# Altium schematic sheet CommonComponents.SchDoc
size Letter; CompanyName: Penn Electric Racing; Organization: Penn Electric Racing; Address1: 220 S. 33rd St; Address2: Towne Bldg, B11; Address3: Philadelpia, PA 19104; Address4: USA; SheetNumber: 1; SheetTotal: 11
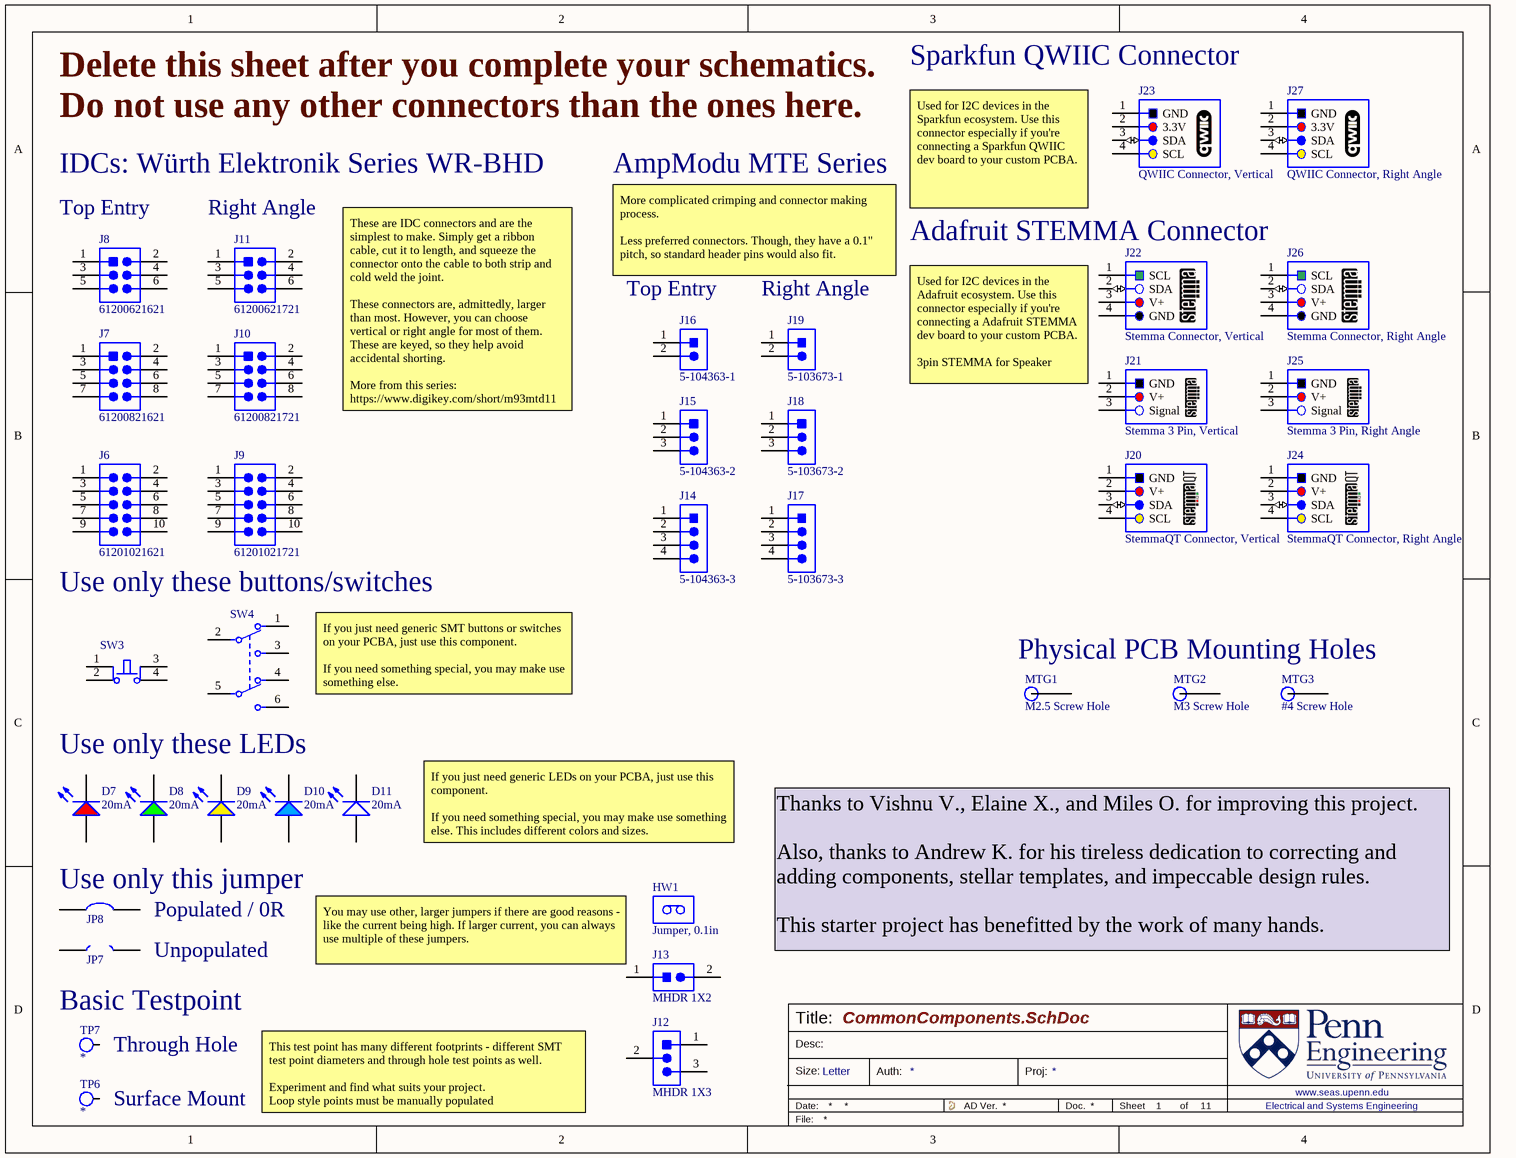
[diagram p0: CommonComponents.SchDoc]

## Parts
D7  Current: 20mA  [LED_0805_RED]  (hidden comment: LSM0805412V)
D8  Current: 20mA  [LED_0805]  (hidden comment: LSM0805452V)
D9  Current: 20mA  [LED_0805_YELLOW]  (hidden comment: LSM0805472V)
D10  Current: 20mA  [LED_0805_BLUE]  (hidden comment: LSM0805463V)
D11  Current: 20mA  [LED_0805_WHITE]  (hidden comment: LSM0805543V)
HW1  Jumper, 0.1in  (mechanical)
J6  61201021621  [61201021621]
J7  61200821621  [61200821621]
J8  61200621621  [61200621621]
J9  61201021721  [61201021721]
J10  61200821721  [61200821721]
J11  61200621721  [61200621721]
J12  MHDR 1X3  [PH1-03-UA WITH CONNECTOR]
J13  MHDR 1X2  [PH1-02-UA]
J14  5-104363-3  [5-104363-3-Footprint-1]
J15  5-104363-2  [5-104363-2-Footprint-1]
J16  5-104363-1  [5-104363-1-Footprint-1]
J17  5-103673-3  [5-103673-3_TYC]
J18  5-103673-2  [5-103673-2-Footprint-1]
J19  5-103673-1  [5-103672-1-Footprint-1]
J20  StemmaQT Connector, Vertical  [FP-BM04B-SRSS-TBT_LF_SN-MFG stemmaqt]
J21  Stemma 3 Pin, Vertical  [FP-B3B-PH-SM4-TBT_LF_SN-MFG]
J22  Stemma Connector, Vertical  [FP-B4B-PH-SM4-TBT_LF_SN-MFG]
J23  QWIIC Connector, Vertical  [FP-BM04B-SRSS-TBT_LF_SN-MFG qwiic]
J24  StemmaQT Connector, Right Angle  [SM04B-SRSS-TB(LF)(SN)-stemmaqt]
J25  Stemma 3 Pin, Right Angle  [FP-S3B-PH-SM4-TB_LF_SN-MFG]
J26  Stemma Connector, Right Angle  [S4B-PH-SM4-TB-Footprint-1]
J27  QWIIC Connector, Right Angle  [SM04B-SRSS-TB(LF)(SN)-qwiic]
JP7  0603 link (Open)  [0603_JP_Open]  (value not drawn)  (no BOM)
JP8  0603 link  [0603_JP_RES]  (value not drawn)
MTG1  M2.5 Screw Hole  [M2.5 Screw Hole-Footprint-1]  (no BOM)
MTG2  M3 Screw Hole  [M3 Screw Hole-Footprint-1]  (no BOM)
MTG3  #4 Screw Hole  [MTG-4]  (no BOM)
SW3  PTS810SJK250SMTRLFS  [PTS810SJK250SMTRLFS-Footprint-1]  (value not drawn)
SW4  JS202011JCQN  [FP-JS202011JCQN-MFG]  (value not drawn)
TP6  Testpad  [SMT Testpoint, 50mil]  (value not drawn)  (no BOM)
TP7  Testpad  [Testpad-HeaderPin]  (value not drawn)  (no BOM)

## Nets

Not connected (* = marked no-connect by the designer): D7 A K; D8 A K; D9 A K; D10 A K; D11 A K; J6 1 2 3 4 5 6 7 8 9 10; J7 1 2 3 4 5 6 7 8; J8 1 2 3 4 5 6; J9 1 2 3 4 5 6 7 8 9 10; J10 1 2 3 4 5 6 7 8; J11 1 2 3 4 5 6; J12 1 2 3; J13 1 2; J14 1 2 3 4; J15 1 2 3; J16 1 2; J17 1 2 3 4; J18 1 2 3; J19 1 2; J20 1(GND) 2(V+) 3(SDA) 4(SCL); J21 1(GND) 2(V+) 3(Signal); J22 1(SCL) 2(SDA) 3(V+) 4(GND); J23 1(GND) 2(3.3V) 3(SDA) 4(SCL); J24 1(GND) 2(V+) 3(SDA) 4(SCL); J25 1(GND) 2(V+) 3(Signal); J26 1(SCL) 2(SDA) 3(V+) 4(GND); J27 1(GND) 2(3.3V) 3(SDA) 4(SCL); JP7 1 2; JP8 1 2; MTG1 1; MTG2 1; MTG3 1; SW3 1 2 3(2) 4; SW4 1 2 3 4 5 6; TP6 1; TP7 1

## Notes on the sheet
- Delete this sheet after you complete your schematics.
- Sparkfun QWIIC Connector
- Do not use any other connectors than the ones here.
- IDCs: Würth Elektronik Series WR-BHD
- (near J8) Top Entry
- (near J11) Right Angle
- AmpModu MTE Series
- Used for I2C devices in the Sparkfun ecosystem. Use this connector especially if you're connecting a Sparkfun QWIIC dev board to your custom PCBA.
- More complicated crimping and connector making process.
  Less preferred connectors. Though, they have a 0.1" pitch, so standard header pins would also fit.
- (near J16) Top Entry
- (near J19) Right Angle
- Adafruit STEMMA Connector
- These are IDC connectors and are the simplest to make. Simply get a ribbon cable, cut it to length, and squeeze the connector onto the cable to both strip and cold weld the joint.
  These connectors are, admittedly, larger than most. However, you can choose vertical or right angle for most of them. These are keyed, so they help avoid accidental shorting.
  More from this series: https://www.digikey.com/short/m93mtd11
- Used for I2C devices in the Adafruit ecosystem. Use this connector especially if you're connecting a Adafruit STEMMA dev board to your custom PCBA.
  3pin STEMMA for Speaker
- Use only these buttons/switches
- If you just need generic SMT buttons or switches on your PCBA, just use this component.
  If you need something special, you may make use something else.
- Physical PCB Mounting Holes
- (near SW4) Use only these LEDs
- If you just need generic LEDs on your PCBA, just use this component.
  If you need something special, you may make use something else. This includes different colors and sizes.
- (near JP8) Use only this jumper
- Populated / 0R
- Unpopulated
- You may use other, larger jumpers if there are good reasons - like the current being high. If larger current, you can always use multiple of these jumpers.
- Thanks to Vishnu V., Elaine X., and Miles O. for improving this project.
  Also, thanks to Andrew K. for his tireless dedication to correcting and adding components, stellar templates, and impeccable design rules.
  This starter project has benefitted by the work of many hands.
- Basic Testpoint
- (near TP7) Through Hole
- (near TP6) Surface Mount
- This test point has many different footprints - different SMT test point diameters and through hole test points as well.
  Experiment and find what suits your project.
  Loop style points must be manually populated
- Title:
- Desc:
- Size:
- Letter
- Auth:
- Proj:
- Sheet
- of
- www.seas.upenn.edu
- Electrical and Systems Engineering

## Library data of the parts
D7 = CMP-00026-00001-2: Single Color LED, RED, 0805; Forward Voltage: 2V; Wavelength - Peak: 625nm; RoHS Compliant: Yes; Test Current: 20mA; Color: Red; Wavelength - Dominant: 625nm
D8 = CMP-00038-4: Single Color LED, Green, 0805; Forward Voltage: 2V; Wavelength - Peak: 571nm; Package (Case): 0805; Test Current: 20mA; RoHS Compliant: Yes; Wavelength - Dominant: 571nm; Color: Green
D9 = CMP-031-000001-1: LED Uni-Color Yellow 590nm Automotive 2-Pin Chip 0805(2012Metric) T/R; Forward Voltage: 2V; RoHS Compliant: Yes; Test Current: 20mA; Color: Yellow
D10 = CMP-00457-1: LED Uni-Color Blue 469nm Automotive 2-Pin Chip 0805(2012Metric) T/R; Package (Case): 0805; Color: Bllue; Forward Voltage: 3V; Wavelength - Dominant: 469nm; Wavelength - Peak: 469nm; Test Current: 20mA; RoHS Compliant: Yes
D11 = CMP-00535-1: LED Uni-Color Blue 469nm Automotive 2-Pin Chip 0805(2012Metric) T/R; Forward Voltage: 3V; Package (Case): 0805; Millicandela Rating: 280m; Color: White; Test Current: 20mA; RoHS Compliant: Yes
HW1 = CMP-00051-1: 2 (1 x 2) Position Shunt Connector, No Grip 0.100" (2.54mm) Gold
J6 = CMP-00633-1: Board Connector, 10 Contact(s), 2 Row(s), Male, Straight, 0.1 inch Pitch, Solder Terminal, Locking, Black Insulator, Receptacle; Manufacturer Series: 6120; PCB Contact Row Spacing: 2.54mm; Body Depth: 0.358inch; MIL Conformance: No; Contact Pattern: RECTANGULAR; Reference Standard: UL; Rated Current (Signal): 3A; Number of Contacts: 10; Contact Style: SQ PIN-SKT; Dielectric Withstanding Voltage (AC): 500V; Polarization Key: POLARIZED HOUSING; Contact Resistance: 20mR; Reliability: COMMERCIAL; Number Of Connectors: 1; Number of Rows Loaded: 2; Option: General Purpose; Body Length: 0.702inch; Insulation Resistance: 1GR; Flammability Rating: UL94 V-0; Number of Rows: 2; Mating Contact Row Spacing: 0.1inch; Terminal Length: 0.118inch; Contact Finish - Mating: GOLD; Max Operating Temperature: 125°C; Termination: Solder; Reach SVHC Compliant: Yes; IEC Conformance: No; PCB Contact Pattern: RECTANGULAR; DIN Conformance: No; Insulation Material: Polybutylene; RoHS Compliant: Yes; JESD-609 Code: e4; Pitch: 2.54mm; Mounting Technology: Board; Mounting Style: STRAIGHT; Mating Contact Pitch: 0.1inch; Insulation Color: Black; Filter Feature: No; Connector Type: BOARD CONNECTOR; Body/Shell Style: RECEPTACLE; Contact Material: Copper Alloy; Number of Positions: 10; Min Operating Temperature: -40°C; Body Breadth: 0.358inch; Number Of PCB Rows: 2; Contact Finish - Termination: Gold (Au) - with Nickel (Ni) barrier; Mixed Contacts: No; Terminal Pitch: 2.54mm; Contact Gender: Male; Mounting Option 1: LOCKING
J7 = CMP-00554-1: Board Connector, 8 Contact(s), 2 Row(s), Male, Straight, Solder Terminal; Manufacturer Series: 6120; Contact Material: Copper Alloy; Reach SVHC Compliant: Yes; Contact Finish - Termination: Gold (Au) - with Nickel (Ni) barrier; RoHS Compliant: Yes; JESD-609 Code: e4; Contact Finish - Mating: GOLD; Connector Type: BOARD CONNECTOR
J8 = CMP-000028-1: Board Connector, 6 Contact(s), 2 Row(s), Male, Straight, Solder Terminal; DIN Conformance: No; Option: General Purpose; Number of Contacts: 6; Number of Rows Loaded: 2; Contact Finish - Mating: GOLD; Flammability Rating: UL94 V-0; RoHS Compliant: Yes; Terminal Pitch: 2.54mm; Contact Material: Copper Alloy; Contact Gender: Male; Mixed Contacts: No; REACH SVHC: Yes; JESD-609 Code: e4; Connector Type: BOARD CONNECTOR; Termination: Solder; Filter Feature: No; MIL Conformance: No; Contact Finish - Termination: Gold (Au) - with Nickel (Ni) barrier; Mount: Board; Mounting Style: STRAIGHT; IEC Conformance: No
J9 = CMP-00636-1: Board Connector, 10 Contact(s), 2 Row(s), Male, Right Angle, 0.1 inch Pitch, Solder Terminal, Locking, Black Insulator; Number of Rows Loaded: 2; PCB Contact Pattern: RECTANGULAR; Number of Contacts: 10; Pitch: 2.54mm; Reliability: COMMERCIAL; Reference Standard: UL; Contact Style: SQ PIN-SKT; Body Depth: 0.521inch; Contact Resistance: 20mR; Insulation Resistance: 1GR; Body Breadth: 0.358inch; Dielectric Withstanding Voltage (AC): 500V; Rated Current (Signal): 3A; Number Of Connectors: 1; Polarization Key: POLARIZED HOUSING; Body Length: 0.802inch; Contact Gender: Male; Mounting Option 1: LOCKING; JESD-609 Code: e4; Insulation Material: Polybutylene; PCB Contact Row Spacing: 2.54mm; Max Operating Temperature: 125°C; Terminal Length: 0.118inch; Mating Contact Pitch: 0.1inch; Contact Finish - Termination: Gold (Au); Reach SVHC Compliant: Yes; Insulation Color: Black; Contact Finish - Mating: GOLD; Number of Rows: 2; RoHS Compliant: Yes; Min Operating Temperature: -40°C; Terminal Pitch: 2.54mm; Number Of PCB Rows: 2; Contact Material: Copper Alloy; Mating Contact Row Spacing: 0.1inch; Mounting Style: RIGHT ANGLE; Mounting Technology: Board; Contact Pattern: RECTANGULAR; Number of Positions: 10; Connector Type: BOARD CONNECTOR; Termination: Solder
J10 = CMP-00555-1: Board Connector, 8 Contact(s), 2 Row(s), Male, Right Angle, 0.1 inch Pitch, Solder Terminal, Locking, Black Insulator; Manufacturer Series: 6120; Contact Pattern: RECTANGULAR; Contact Resistance: 20mR; Polarization Key: POLARIZED HOUSING; Number Of PCB Rows: 2; Insulation Resistance: 1GR; Number Of Connectors: 1; Number of Contacts: 8; Body Depth: 0.521inch; Reference Standard: UL; Dielectric Withstanding Voltage (AC): 500V; PCB Contact Row Spacing: 2.54mm; Rated Current (Signal): 3A; Reliability: COMMERCIAL; Body Breadth: 0.358inch; Contact Style: SQ PIN-SKT; Body Length: 0.702inch; Termination: Solder; Mounting Technology: Board; JESD-609 Code: e4; Mounting Option 1: LOCKING; Contact Material: Copper Alloy; Reach SVHC Compliant: Yes; Mating Contact Row Spacing: 0.1inch; Contact Finish - Termination: Gold (Au); Mounting Style: RIGHT ANGLE; Min Operating Temperature: -40°C; PCB Contact Pattern: RECTANGULAR; Insulation Material: Polybutylene; Contact Finish - Mating: GOLD; Terminal Pitch: 2.54mm; Contact Gender: Male; Insulation Color: Black; Connector Type: BOARD CONNECTOR; Mating Contact Pitch: 0.1inch; RoHS Compliant: Yes; Terminal Length: 0.118inch; Number of Rows Loaded: 2; Max Operating Temperature: 125°C
J11 = CMP-00552-1: Board Connector, 6 Contact(s), 2 Row(s), Male, Right Angle, 0.1 inch Pitch, Solder Terminal, Locking, Black Insulator; Manufacturer Series: 6120; Reference Standard: UL; Number Of Connectors: 1; Body Length: 0.602inch; Rated Current (Signal): 3A; Dielectric Withstanding Voltage (AC): 500V; Contact Pattern: RECTANGULAR; Contact Style: SQ PIN-SKT; Body Depth: 0.521inch; Contact Resistance: 20mR; Insulation Resistance: 1GR; Number Of PCB Rows: 2; Number of Contacts: 6; Polarization Key: POLARIZED HOUSING; Reliability: COMMERCIAL; PCB Contact Row Spacing: 2.54mm; Body Breadth: 0.358inch; Contact Material: Copper Alloy; Mounting Style: RIGHT ANGLE; Mounting Technology: Board; Mating Contact Row Spacing: 0.1inch; Mounting Option 1: LOCKING; PCB Contact Pattern: RECTANGULAR; Reach SVHC Compliant: Yes; Number of Rows: 2; Mating Contact Pitch: 0.1inch; Insulation Material: Polybutylene; Insulation Color: Black; RoHS Compliant: Yes; Contact Gender: Male; Termination: Solder; Connector Type: BOARD CONNECTOR; Min Operating Temperature: -40°C; Max Operating Temperature: 125°C; Contact Finish - Mating: GOLD; Number of Rows Loaded: 2; Terminal Length: 0.118inch; Pitch: 2.54mm; Contact Finish - Termination: Gold (Au); Number of Positions: 6; Terminal Pitch: 2.54mm; JESD-609 Code: e4
J12 = CMP-000023-1: Header, 3-Pin, 0.1in Pitch, Male
J13 = CMP-000021-1: Header, 2-Pin, 0.1in Pitch, Male
J14 = CMP-00105-2: Board Connector, 4 Contact(s), 1 Row(s), Male, Straight, 0.1 inch Pitch, Solder Terminal, Locking, Black Insulator, Plug
J15 = CMP-00106-1: Board Connector, 3 Contact(s), 1 Row(s), Male, Straight, 0.1 inch Pitch, Solder Terminal, Latch, Black Insulator, Plug
J16 = CMP-0000361-2: Board Connector, 2 Contact(s), 1 Row(s), Male, Straight, 0.1 inch Pitch, Solder Terminal, Latch, Black Insulator, Plug; Option: General Purpose; Body Depth: 0.535inch; Contact Pattern: RECTANGULAR; Dielectric Withstanding Voltage (AC): 600V; DIN Conformance: No; Rated Current (Signal): 3A; Body Breadth: 0.262inch; Contact Style: SQ PIN-SKT; Number of Contacts: 2; Body Length: 0.3inch; Number Of Connectors: 1; Polarization Key: POLARIZED HOUSING; Reliability: COMMERCIAL; Reference Standard: UL; Insulation Resistance: 5GR; Plating Thickness: 15uin; Mounting Option 1: LOCKING; Insulation Color: Black; Body/Shell Style: PLUG; MIL Conformance: No; REACH SVHC: Yes; Mixed Contacts: No; IEC Conformance: No; Connector Type: BOARD CONNECTOR; Min Operating Temperature: -65°C; RoHS Compliant: Yes; PCB Contact Pattern: RECTANGULAR; Mating Contact Pitch: 0.1inch; Termination: Solder; Max Operating Temperature: 105°C; Filter Feature: No; Insulation Material: Glass; Mounting Style: STRAIGHT; Mount: Board; Contact Gender: Male; Number of Rows Loaded: 1; Contact Finish - Mating: NOT SPECIFIED; Terminal Pitch: 2.54mm; Number Of PCB Rows: 1; Contact Material: Brass; Terminal Length: 0.13inch
J17 = CMP-251-000000-2: Board Connector, 4 Contact(s), 1 Row(s), Male, Right Angle, Solder Terminal, Black Insulator; Mfr_Name: TE Connectivity; Mixed Contacts: No; Number of Contacts: 4; Mating Information: MULTIPLE MATING PARTS AVAILABLE; Option: General Purpose; Number of Rows Loaded: 1; Additional Feature: POLARIZED; Termination: Solder; Design Item ID: 5-103673-3; DIN Conformance: No; RoHS Compliant: Yes; Reach SVHC Compliant: Yes; Type: Type; Mounting Technology: Board; Contact Gender: Male; Pin Count: 4; Mounting Style: RIGHT ANGLE; Filter Feature: No; Contact Material: Brass; Contact Finish - Termination: TIN; Source: 5-103673-3.SchLib; Flammability Rating: UL94 V-0; RefDes: RefDes; Component Type: Standard; Connector Type: BOARD CONNECTOR; IEC Conformance: No; Terminal Pitch: 2.54mm; MIL Conformance: No; JESD-609 Code: e3; Contact Finish - Mating: NOT SPECIFIED
J18 = CMP-00385-1: Board Connector, 3 Contact(s), 1 Row(s), Male, Right Angle, Solder Terminal, Black Insulator; Option: General Purpose; MIL Conformance: No; Number of Contacts: 3; Mating Information: MULTIPLE MATING PARTS AVAILABLE; Number of Rows Loaded: 1; Additional Feature: POLARIZED; Flammability Rating: UL94 V-0; RoHS Compliant: Yes; JESD-609 Code: e3; Contact Finish - Mating: NOT SPECIFIED; Reach SVHC Compliant: Yes; Connector Type: BOARD CONNECTOR; Filter Feature: No; IEC Conformance: No; Mounting Style: RIGHT ANGLE; Terminal Pitch: 2.54mm; Contact Material: Brass; Termination: Solder; Mounting Technology: Board; Mixed Contacts: No; Contact Finish - Termination: TIN; Contact Gender: Male; DIN Conformance: No
J19 = CMP-00384-1: Board Connector, 2 Contact(s), 1 Row(s), Male, Right Angle, 0.1 inch Pitch, Solder Terminal, Latch, Black Insulator, Receptacle; DIN Conformance: No; Rated Current (Signal): 3A; Number of Contacts: 2; Contact Pattern: RECTANGULAR; Body Depth: 0.535inch; Number Of PCB Rows: 1; Mating Information: MULTIPLE MATING PARTS AVAILABLE; Contact Style: SQ PIN-SKT; Option: General Purpose; Body Breadth: 0.275inch; Additional Feature: POLARIZED; Dielectric Withstanding Voltage (AC): 600V; Contact Resistance: 15mR; Plating Thickness: 15uin; Mounting Option 2: LOCKING; Reliability: COMMERCIAL; Body Length: 0.3inch; Insulation Resistance: 5GR; Board Mounting Option: HOLE .125-.137; Reference Standard: UL; Polarization Key: POLARIZED HOUSING; Min Operating Temperature: -65°C; Mating Contact Pitch: 0.1inch; Contact Gender: Male; Mounting Option 1: LATCH; Mounting Style: RIGHT ANGLE; Terminal Length: 0.13inch; Contact Material: Brass; PCB Contact Pattern: RECTANGULAR; JESD-609 Code: e3; Mounting Technology: Board; Body/Shell Style: RECEPTACLE; Contact Finish - Mating: NOT SPECIFIED; Number of Rows Loaded: 1; Termination: Solder; Terminal Pitch: 2.54mm; Contact Finish - Termination: TIN; IEC Conformance: No; Filter Feature: No; MIL Conformance: No; Reach SVHC Compliant: Yes; Number Of Connectors: 1; Insulation Material: Thermoplastic; Connector Type: BOARD CONNECTOR; Max Operating Temperature: 105°C; Mixed Contacts: No; Flammability Rating: UL94 V-0; Insulation Color: Black; RoHS Compliant: Yes
J20 = CMP-00562-2: Adafruit StemmaQT Connector Header, 1.0mm Pitch, Ultra-Compact, Low Profile Design, Interchangeable Shrouded Header; ComponentLink2Description: StemmaQT Info; ComponentLink1Description: qwiic info; ComponentLink1URL: https://www.sparkfun.com/qwiic; ComponentLink2URL: https://learn.adafruit.com/introducing-adafruit-stemma-qt/what-is-stemma-qt
J21 = CMP-00550-1: Adafruit Stemma 3 Pin (Analog/Digital/PWM) Connector Header, PH Series, 3 Position, 2.00mm, 100V, Surface Mount, Solder, Pick and Place, Natural.
J22 = CMP-00546-1: Adafruit Stemma - Conn Shrouded Header HDR 4 POS 2mm Solder ST SMD T/R
J23 = CMP-00560-1: Sparkfun QWIIC Connector Header, 1.0mm Pitch, Ultra-Compact, Low Profile Design, Interchangeable Shrouded Header; ComponentLink1URL: https://www.sparkfun.com/qwiic; ComponentLink1Description: qwiic info
J24 = CMP-00561-2: Adafruit StemmaQT Connector Header, Side Entry, SR Series, 4 Position, 1.00mm, 50V, Surface Mount, Tin, Natural; ComponentLink1URL: https://www.sparkfun.com/qwiic; ComponentLink2URL: https://learn.adafruit.com/introducing-adafruit-stemma-qt/what-is-stemma-qt; ComponentLink2Description: StemmaQT Info; ComponentLink1Description: qwiic Info
J25 = CMP-00549-2: Adafruit Stemma 3 Pin (Analog/Digital/PWM) Connector Header, PH Series, 3 Position, Side Entry, 2.00mm, Solder, Surface Mount, Natural.
J26 = CMP-00548-1: Adafruit Stemma, Right Angle, Header S4B-PH-SM4-TB, 2.00mm, 4-contacts, side entry, SMT, /1000/reel
J27 = CMP-00481-9: Sparkfun QWIIC Connector Header, Side Entry, SR Series, 4 Position, 1.00mm, 50V, Surface Mount, Tin, Natural; ComponentLink2Description: StemmaQT Info; ComponentLink2URL: https://learn.adafruit.com/introducing-adafruit-stemma-qt/what-is-stemma-qt; ComponentLink1Description: qwiic Info; ComponentLink1URL: https://www.sparkfun.com/qwiic
JP7 = CMP-00423-2: 0O link, Solder Bridge/SMD, Open; Value: 10000000000meg; P/N: 0603 link (Open); Description in Visual: 0O link, Solder Bridge/SMD, Open; Component Type: Standard (No BOM); Design Item ID: 0603 link (Open); Pin Count: 2; Source: Shunts and Jumpers.SchLib
JP8 = CMP-00422-5: 0O link, SMD, 0603, Solder Bridge Option; Manufacturer P/N: Various; Manufacturer: Generic; Description in Visual: 0O link, Solder Bridge/SMD, Open; Value: 0.025; Source: Shunts and Jumpers.SchLib; Pin Count: 2; Design Item ID: 0603 link; Component Type: Net Tie; P/N: 0603 link
MTG1 = CMP-00065-3: Close clearance Fit for M2.5 Screw Hole; PCB Mounting for M2.5 Screw
MTG2 = CMP-00028-4: Close clearance Fit for M3 Screw Hole; PCB Mounting for M3 Screw
MTG3 = CMP-00388-3: Close clearance Fit for #4 Screw Hole; PCB Mounting for #4 Screw (4-40, etc); Component Name: MTG #4; P/N: MTG #4; Pin Count: 1; PCB Package: #4; Symbol Name: MTG #4
SW3 = CMP-00084-6: Keypad Switch, 1 Switches, SPST, Momentary tactile button, 0.05A, 16VDC, 3.23N, Solder Terminal, Surface Mount-straight; Manufacturer Series: PTS810; Actuator Length: 0.028inch; Electrical Life: 50000Cycles; Contact Resistance: 0.5mR; Solderability: REFLOW; Actuator Travel: 0.1524mm; Actuator Color: White; Actuator Type: Pushbutton; Insulation Resistance: 100MR; Dielectric Withstand Volts: 250VACV; Switch Function: OFF-MOM; Reach SVHC Compliant: Yes; Terminal Finish: Silver; Switch Type: Keypad; Switch Action: MOMENTARY; RoHS Compliant: Yes; JESD-609 Code: e4; Max Operating Temperature: 85°C; Termination: Solder; Min Operating Temperature: -40°C; Mounting Technology: Surface Mount; Circuit: SPST; Type: Tactile
SW4 = CMP-00536-1: Slide Switch, 2 Positions, DPDT, Latched, 0.3A, 6VDC, Solder Terminal, Surface Mount-straight; Switch Function: ON-ON; Type: Slide; Circuit: DPDT
TP6 TP7 = CMP-00049-8: Test Pad/Point (Testpoint, Testpad), for probing; NetName: *